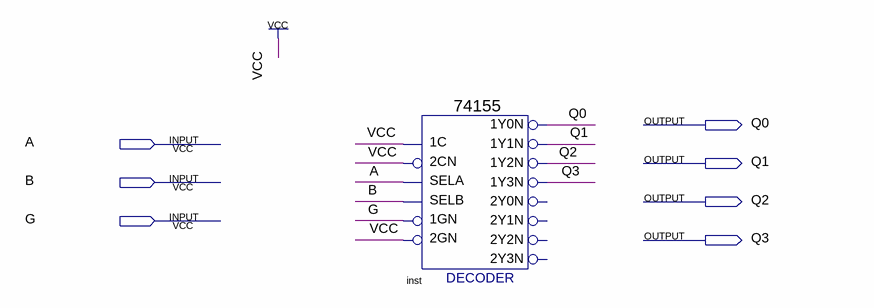
[diagram p0: schematic sheet]
// Quartus schematic two_multiply_four_Demux_seven_four_one_five_five.bdf as structural Verilog: 1 symbols, 7 pins
module two_multiply_four_Demux_seven_four_one_five_five (
  input  A,
  input  B,
  input  G,
  output Q0,
  output Q1,
  output Q2,
  output Q3
);

  \74155  inst (
    .\1C (1'b1), .\2CN (1'b1), .SELB(B), .SELA(A), .\1GN (G), .\2GN (1'b1), .\1Y2N (Q2), .\1Y1N (Q1),
    .\1Y0N (Q0), .\1Y3N (Q3));  // open: 2Y1N, 2Y0N, 2Y3N, 2Y2N
endmodule
